# Altium project Canboardwpremadeteensy.PrjPCB
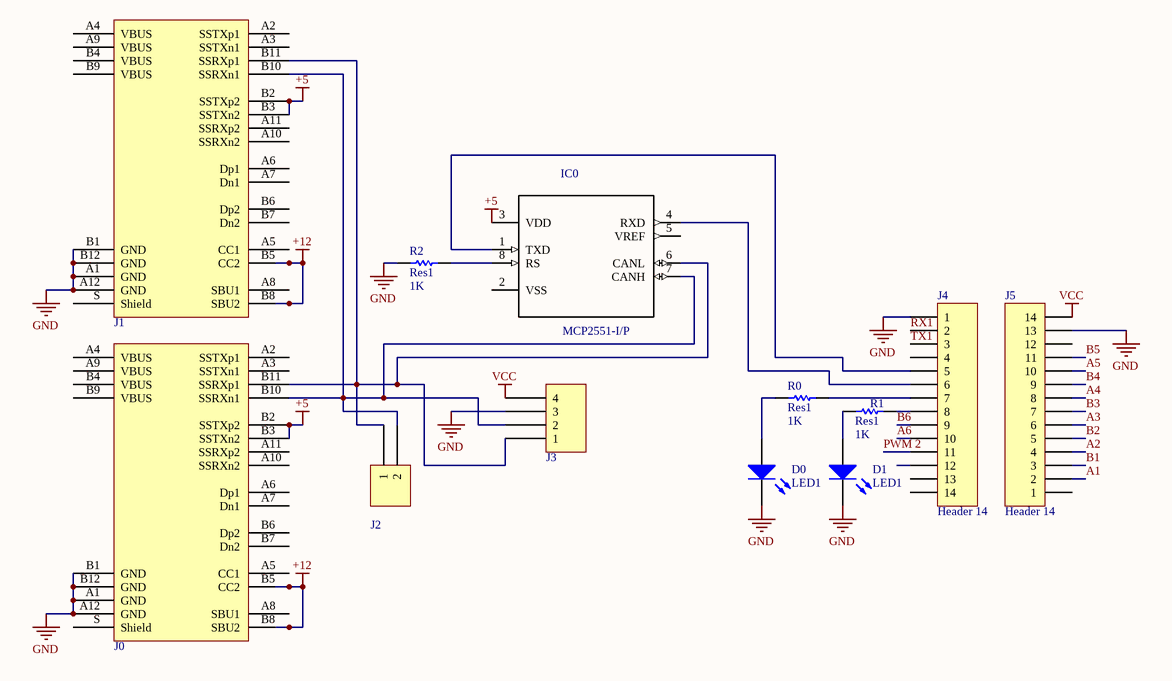
[diagram p0: SensorBoardSchematic.SchDoc]
2 sheets, 19 parts. Net scope: global (net labels, ports and power ports of the same name join across sheets).
Board file: SensorBoard.PcbDoc
Sheets:
  SensorBoardSchematic.SchDoc
  Sensor Input.SchDoc

## Sheet SensorBoardSchematic.SchDoc
size A4

### Parts
(Parts that share a designator on the sheet are numbered #1, #2 ... from top to bottom, then left to right.)
D0  LED1  [LED-1]
D1  LED1  [LED-1]
IC0  MCP2551-I/P  [DIP254P762X432-8]
J0#1  USB C  [TE USB-C 2129691-1]  (value not drawn)
J1#1  USB C  [TE USB-C 2129691-1]  (value not drawn)
J2#1  282834-2  [TE 282834-2]  (value not drawn)
J3#1  282834-4  [TE 282834-4]  (value not drawn)
J4#1  Header 14  [HDR1X14]
J5#1  Header 14  [HDR1X14]
R0  Res1  value 1K  [AXIAL-0.3]
R1  Res1  value 1K  [AXIAL-0.3]
R2  Res1  value 1K  [AXIAL-0.3]

### Nets
+5: IC0.3(VDD) J0#1.B2(SSTXp2) J0#1.B3(SSTXn2) J1#1.B2(SSTXp2) J1#1.B3(SSTXn2)
+12: J0#1.B5(CC2) J0#1.B8(SBU2) J1#1.B5(CC2) J1#1.B8(SBU2)
GND: D0.2(K) D1.2(K) J0#1.A1(GND) J0#1.A12(GND) J0#1.B1(GND) J0#1.B12(GND) J1#1.A1(GND) J1#1.A12(GND) J1#1.B1(GND) J1#1.B12(GND) J3#1.3 J4#1.1 J5#1.13 R2.2
VCC: J3#1.4 J5#1.14
A1: J5#1.2
A2: J5#1.4
A3: J5#1.6
A4: J5#1.8
A5: J5#1.10
A6: J4#1.10
B1: J5#1.3
B2: J5#1.5
B3: J5#1.7
B4: J5#1.9
B5: J5#1.11
B6: J4#1.9
PWM 2: J4#1.11
RX1: J4#1.2
TX1: J4#1.3
NetD0_1: D0.1(A) R0.2
NetD1_1: D1.1(A) R1.2
NetIC0_1: IC0.1(TXD) J4#1.5
NetIC0_4: IC0.4(RXD) J4#1.6
NetIC0_6: IC0.6(CANL) J0#1.B11(SSRXp1) J1#1.B11(SSRXp1) J2#1.1 J3#1.1
NetIC0_7: IC0.7(CANH) J0#1.B10(SSRXn1) J1#1.B10(SSRXn1) J2#1.2 J3#1.2
NetIC0_8: IC0.8(RS) R2.1
NetJ4#1_7: J4#1.7 R0.1
NetJ4#1_8: J4#1.8 R1.1

Not connected (* = marked no-connect by the designer): IC0 2(VSS) 5(VREF); J0#1 A2(SSTXp1) A3(SSTXn1) A4(VBUS) A5(CC1) A6(Dp1) A7(Dn1) A8(SBU1) A9(VBUS) A10(SSRXn2) A11(SSRXp2) B4(VBUS) B6(Dp2) B7(Dn2) B9(VBUS) S(Shield); J1#1 A2(SSTXp1) A3(SSTXn1) A4(VBUS) A5(CC1) A6(Dp1) A7(Dn1) A8(SBU1) A9(VBUS) A10(SSRXn2) A11(SSRXp2) B4(VBUS) B6(Dp2) B7(Dn2) B9(VBUS) S(Shield); J4#1 4 12 13 14; J5#1 1 12

### Library data of the parts
D0 D1 = LED1: Typical RED GaAs LED; Published: 8-Jun-2000; LatestRevisionDate: 08-Jul-2005; LatestRevisionNote: Mech Layer 1 removed.; PackageReference: LED-1; Publisher: Altium Limited; PackageDescription: LED; 2 Leads
IC0 = MCP2551-I/P: IC TRANSCEIVER CAN HI-SPD 8-DIP; MF: Microchip; MP: MCP2551-I/P; Package: DIP-8 Microchip; Price: 0.97 USD; Availability: Good; Value: *
J0#1 J1#1 = 2129691-1: USB 3.1 TYPE C MID MOUNT HYBRID; Manufacturer: TE Connectivity AMP Connectors; Number Of Positions: 24; PartId: 7863; Part Number: 2129691-1; Supplier 1: Digi-Key; Supplier Part Number 1: A122008TR-ND; ComponentLink1Description: Datasheet; ComponentLink1URL: http://media.digikey.com/pdf/Data%20Sheets/Tyco%20Electonics%20AMP%20PDFs/2129691_Dwg.pdf; ComponentLink2Description: Digi-Key Listing; ComponentLink2URL: http://www.digikey.ca/product-detail/en/2129691-1/A122008TR-ND/5401336; Price: 2.2088; Type: USB - C; Series: USB 3.1, Superspeed+
J2#1 = 282834-2: TERM BLOCK 2POS SIDE ENT 2.54MM; Manufacturer: TE Connectivity AMP Connectors; TemperatureRange: -40C ~ 105C; Voltage: 150V; Pitch: 0.100" (2.54mm); Number Of Levels: 1; Positions Per Level: 2; PartId: 9289; Part Number: 282834-2; Supplier 1: Digi-Key; Supplier Part Number 1: A98333-ND; ComponentLink1Description: Datasheet; ComponentLink1URL: http://www.te.com/commerce/DocumentDelivery/DDEController?Action=srchrtrv&DocNm=282834&DocType=Customer+Drawing&DocLang=English; ComponentLink2Description: Digi-Key Listing; ComponentLink2URL: http://www.digikey.ca/product-detail/en/282834-2/A98333-ND/1150135; Price: 1.3; Colour: Green; Orientation: Horizontal with Board
J3#1 = 282834-4: TERM BLOCK 4POS SIDE ENT 2.54MM; Manufacturer: TE Connectivity AMP Connectors; TemperatureRange: -40C ~ 105C; Voltage: 150V; Pitch: 0.100" (2.54mm); Number Of Levels: 1; Positions Per Level: 4; PartId: 9291; Part Number: 282834-4; Supplier 1: Digi-Key; Supplier Part Number 1: A98335-ND; ComponentLink1Description: Datasheet; ComponentLink1URL: http://www.te.com/commerce/DocumentDelivery/DDEController?Action=srchrtrv&DocNm=282834&DocType=Customer+Drawing&DocLang=English; ComponentLink2Description: Digi-Key Listing; ComponentLink2URL: http://www.digikey.ca/product-detail/en/282834-4/A98335-ND/1153265; Price: 3.34; Colour: Green; Orientation: Horizontal with Board
J4#1 J5#1 = Header 14: Header, 14-Pin; LatestRevisionDate: 17-Jul-2002; LatestRevisionNote: Re-released for DXP Platform.; Publisher: Altium Limited
R0-R2 = Res1: Resistor; Published: 8-Jun-2000; LatestRevisionDate: 17-Jul-2002; LatestRevisionNote: Re-released for DXP Platform.; PackageReference: AXIAL-0.3; Publisher: Altium Limited; PackageDescription: Axial Device, Thru-Hole; 2 Leads; 0.3 in Pin Spacing

## Sheet Sensor Input.SchDoc
size A
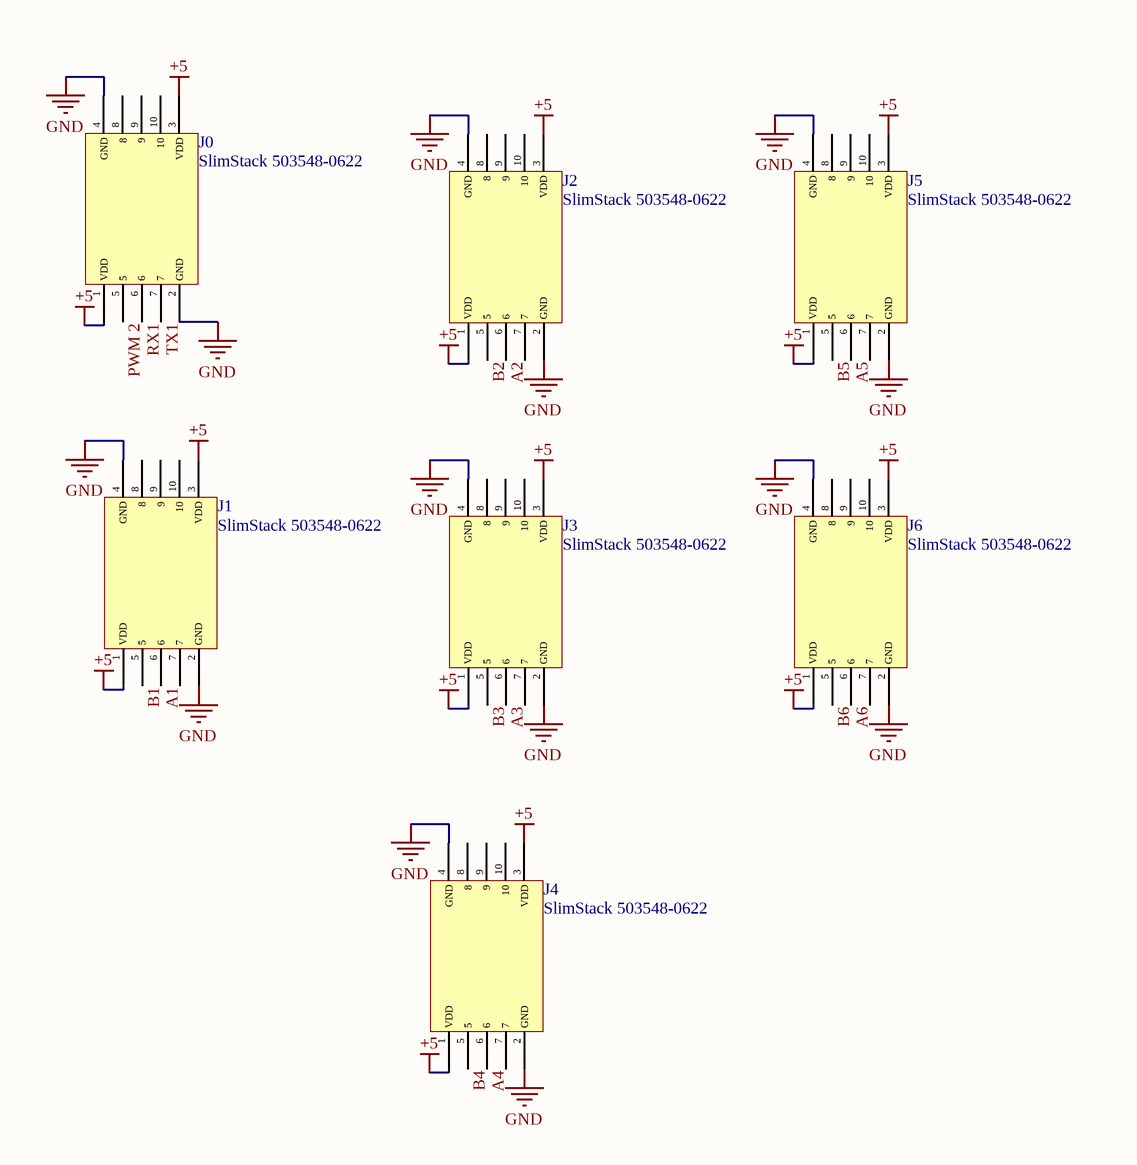
[diagram p1: Sensor Input.SchDoc]

### Parts
(Parts that share a designator on the sheet are numbered #1, #2 ... from top to bottom, then left to right.)
J0#2  SlimStack 503548-0622  [SlimStack_503548-0622]
J1#2  SlimStack 503548-0622  [SlimStack_503548-0622]
J2#2  SlimStack 503548-0622  [SlimStack_503548-0622]
J3#2  SlimStack 503548-0622  [SlimStack_503548-0622]
J4#2  SlimStack 503548-0622  [SlimStack_503548-0622]
J5#2  SlimStack 503548-0622  [SlimStack_503548-0622]
J6  SlimStack 503548-0622  [SlimStack_503548-0622]

### Nets
+5: J0#2.1(VDD) J0#2.3(VDD) J1#2.1(VDD) J1#2.3(VDD) J2#2.1(VDD) J2#2.3(VDD) J3#2.1(VDD) J3#2.3(VDD) J4#2.1(VDD) J4#2.3(VDD) J5#2.1(VDD) J5#2.3(VDD) J6.1(VDD) J6.3(VDD)
GND: J0#2.2(GND) J0#2.4(GND) J1#2.2(GND) J1#2.4(GND) J2#2.2(GND) J2#2.4(GND) J3#2.2(GND) J3#2.4(GND) J4#2.2(GND) J4#2.4(GND) J5#2.2(GND) J5#2.4(GND) J6.2(GND) J6.4(GND)
A1: J1#2.6
A2: J2#2.6
A3: J3#2.6
A4: J4#2.6
A5: J5#2.6
A6: J6.6
B1: J1#2.5
B2: J2#2.5
B3: J3#2.5
B4: J4#2.5
B5: J5#2.5
B6: J6.5
PWM 2: J0#2.5
RX1: J0#2.6
TX1: J0#2.7

Not connected (* = marked no-connect by the designer): J0#2 8 9 10; J1#2 7 8 9 10; J2#2 7 8 9 10; J3#2 7 8 9 10; J4#2 7 8 9 10; J5#2 7 8 9 10; J6 7 8 9 10

### Library data of the parts
J0#2 J1#2 J2#2 J3#2 J4#2 J5#2 J6 = SlimStack_503548-0622

## Nets that join several sheets
+5: SensorBoardSchematic (5 pins), Sensor Input (14 pins)
GND: SensorBoardSchematic (14 pins), Sensor Input (14 pins)
A1: SensorBoardSchematic (J5#1.2), Sensor Input (J1#2.6)
A2: SensorBoardSchematic (J5#1.4), Sensor Input (J2#2.6)
A3: SensorBoardSchematic (J5#1.6), Sensor Input (J3#2.6)
A4: SensorBoardSchematic (J5#1.8), Sensor Input (J4#2.6)
A5: SensorBoardSchematic (J5#1.10), Sensor Input (J5#2.6)
A6: SensorBoardSchematic (J4#1.10), Sensor Input (J6.6)
B1: SensorBoardSchematic (J5#1.3), Sensor Input (J1#2.5)
B2: SensorBoardSchematic (J5#1.5), Sensor Input (J2#2.5)
B3: SensorBoardSchematic (J5#1.7), Sensor Input (J3#2.5)
B4: SensorBoardSchematic (J5#1.9), Sensor Input (J4#2.5)
B5: SensorBoardSchematic (J5#1.11), Sensor Input (J5#2.5)
B6: SensorBoardSchematic (J4#1.9), Sensor Input (J6.5)
PWM 2: SensorBoardSchematic (J4#1.11), Sensor Input (J0#2.5)
RX1: SensorBoardSchematic (J4#1.2), Sensor Input (J0#2.6)
TX1: SensorBoardSchematic (J4#1.3), Sensor Input (J0#2.7)